# Altium schematic sheet CCP_MCU_IO_CN12.SchDoc
size A
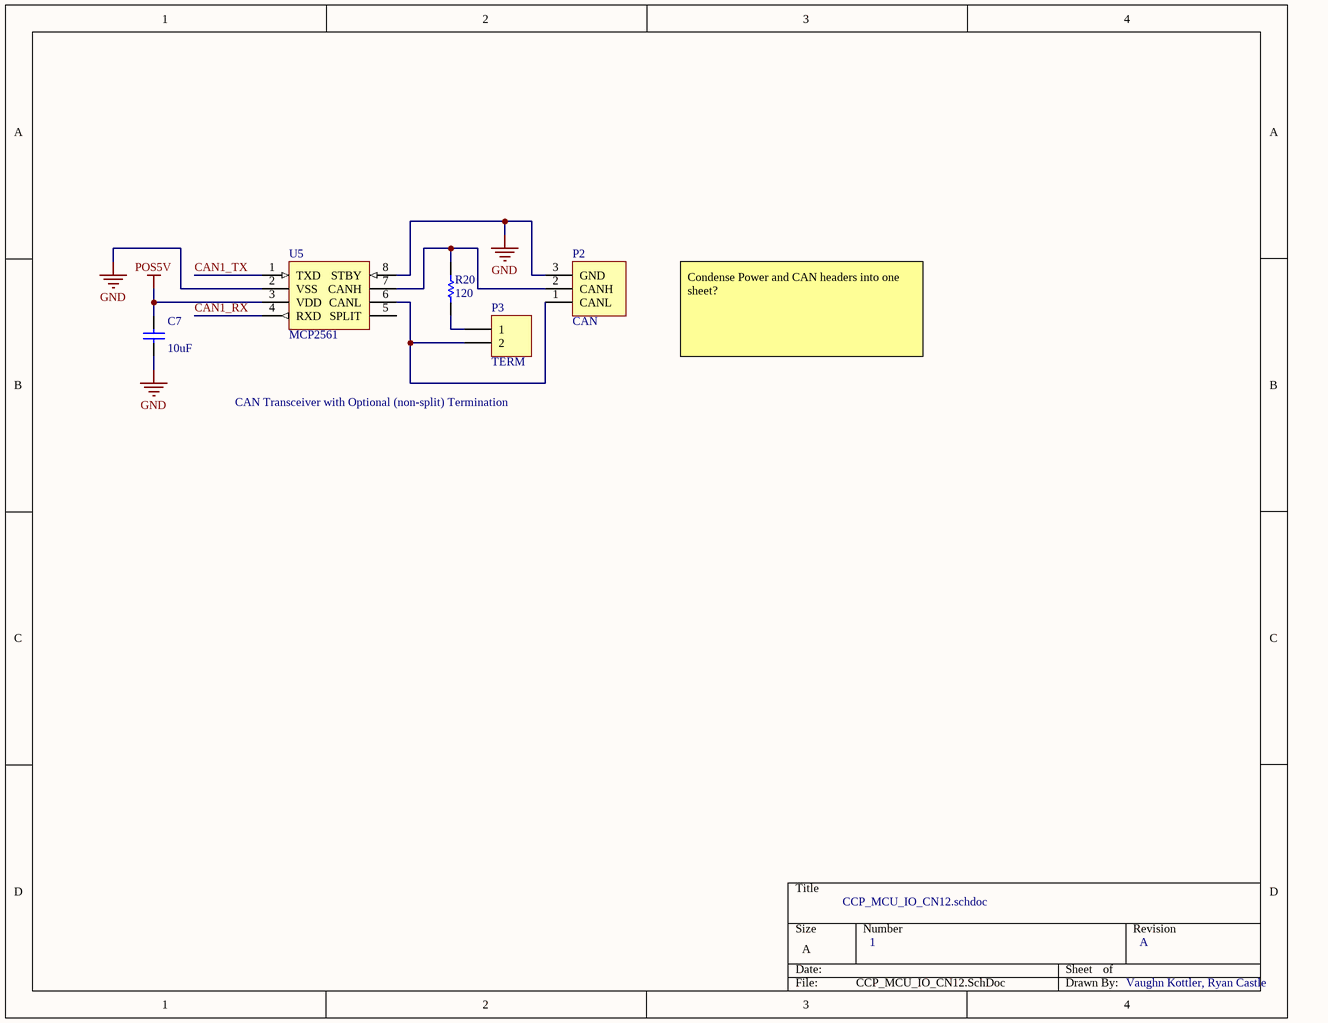
[diagram p0: CCP_MCU_IO_CN12.SchDoc]

## Parts
C7  value 10uF  [C1206]  (hidden comment: Cap)
P2  CAN  [3POS TERM BLOCK]
P3  TERM  [HDR1X2]
R20  value 120  [6-0805_M]  (hidden comment: Res1)
U5  MCP2561  [SO8_L]

## Nets
GND: C7.1 P2.3(GND) U5.2(VSS) U5.8(STBY)
POS5V: C7.2 U5.3(VDD)
CAN1_RX: U5.4(RXD)
CAN1_TX: U5.1(TXD)
NetP2_1: P2.1(CANL) P3.2 U5.6(CANL)
NetP2_2: P2.2(CANH) R20.2 U5.7(CANH)
NetP3_1: P3.1 R20.1

Not connected (* = marked no-connect by the designer): U5 5(SPLIT)

## Notes on the sheet
- Condense Power and CAN headers into one sheet?
- CAN Transceiver with Optional (non-split) Termination
- CCP_MCU_IO_CN12.schdoc
- 1
- A
- Vaughn Kottler, Ryan Castle

## Library data of the parts
C7 = Cap: Capacitor; Published: 8-Jun-2000; LatestRevisionDate: 17-Jul-2002; LatestRevisionNote: Re-released for DXP Platform.; PackageReference: RAD-0.3; Publisher: Altium Limited; PackageDescription: Radial Cap, Thru-Hole; 2 Leads; 0.3 in Pin Spacing
P3 = Header 2: Header, 2-Pin; LatestRevisionDate: 17-Jul-2002; LatestRevisionNote: Re-released for DXP Platform.; Publisher: Altium Limited
R20 = Res1: Resistor; Published: 8-Jun-2000; LatestRevisionDate: 17-Jul-2002; LatestRevisionNote: Re-released for DXP Platform.; PackageReference: AXIAL-0.3; Publisher: Altium Limited; PackageDescription: Axial Device, Thru-Hole; 2 Leads; 0.3 in Pin Spacing
U5 = MCP2561: CAN Transciever; ComponentLink1Description: Part; ComponentLink1URL: https://www.digikey.com/product-detail/en/microchip-technology/MCP2561-E-SN/MCP2561-E-SN-ND/4079961; ComponentLink2Description: Datasheet; ComponentLink2URL: http://ww1.microchip.com/downloads/en/DeviceDoc/20005167C.pdf